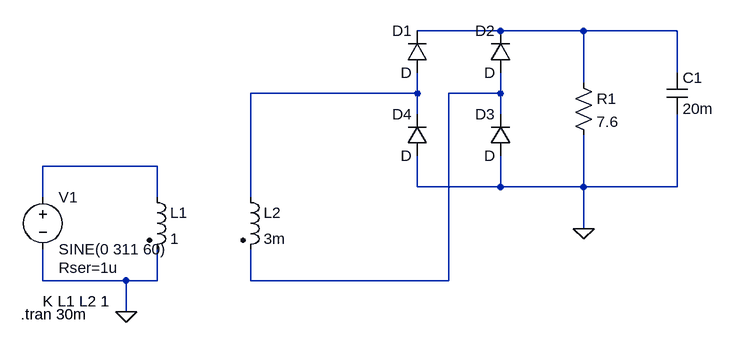
[diagram p0: schematic A03 - Simulacao.asc]
A03 - Simulacao.asc, the LTspice schematic file:
Version 4
SHEET 1 880 680
WIRE 384 0 256 0
WIRE 512 0 384 0
WIRE 656 0 512 0
WIRE 656 64 656 0
WIRE 512 80 512 0
WIRE 256 96 256 64
WIRE 256 96 0 96
WIRE 384 96 384 64
WIRE 384 96 304 96
WIRE 256 128 256 96
WIRE 384 128 384 96
WIRE -144 208 -320 208
WIRE 256 240 256 192
WIRE 384 240 384 192
WIRE 384 240 256 240
WIRE 512 240 512 160
WIRE 512 240 384 240
WIRE 656 240 656 128
WIRE 656 240 512 240
WIRE -320 256 -320 208
WIRE -144 256 -144 208
WIRE 0 256 0 96
WIRE 512 304 512 240
WIRE -320 384 -320 336
WIRE -192 384 -320 384
WIRE -144 384 -144 336
WIRE -144 384 -192 384
WIRE 0 384 0 336
WIRE 304 384 304 96
WIRE 304 384 0 384
WIRE -192 432 -192 384
FLAG -192 432 0
FLAG 512 304 0
SYMBOL diode 272 64 R180
WINDOW 0 24 64 Left 2
WINDOW 3 24 0 Left 2
SYMATTR InstName D1
SYMBOL diode 400 64 R180
WINDOW 0 24 64 Left 2
WINDOW 3 24 0 Left 2
SYMATTR InstName D2
SYMBOL diode 400 192 R180
WINDOW 0 24 64 Left 2
WINDOW 3 24 0 Left 2
SYMATTR InstName D3
SYMBOL diode 272 192 R180
WINDOW 0 24 64 Left 2
WINDOW 3 24 0 Left 2
SYMATTR InstName D4
SYMBOL cap 640 64 R0
SYMATTR InstName C1
SYMATTR Value 20m
SYMBOL voltage -320 240 R0
WINDOW 123 0 0 Left 0
WINDOW 39 24 124 Left 2
SYMATTR InstName V1
SYMATTR Value SINE(0 311 60)
SYMATTR SpiceLine Rser=1u
SYMBOL ind2 -160 240 R0
SYMATTR InstName L1
SYMATTR Value 1
SYMATTR Type ind
SYMBOL ind2 -16 240 R0
SYMATTR InstName L2
SYMATTR Value 3m
SYMATTR Type ind
SYMBOL res 496 64 R0
SYMATTR InstName R1
SYMATTR Value 7.6
TEXT -320 416 Left 2 !K L1 L2 1
TEXT -354 436 Left 2 !.tran 30m

The netlist it stands for:
* A03 - Simulacao.asc
D1 N002 N001 D
D2 N003 N001 D
D3 0 N003 D
D4 0 N002 D
C1 N001 0 20m
V1 N004 0 SINE(0 311 60) Rser=1u
L1 N004 0 1
L2 N002 N003 3m
R1 N001 0 7.6
.model D D
.lib standard.dio
K L1 L2 1
.tran 30m
.backanno
.end